# EAGLE schematic NRF8001_BLE_COMMS (EAGLE 7.7.0)
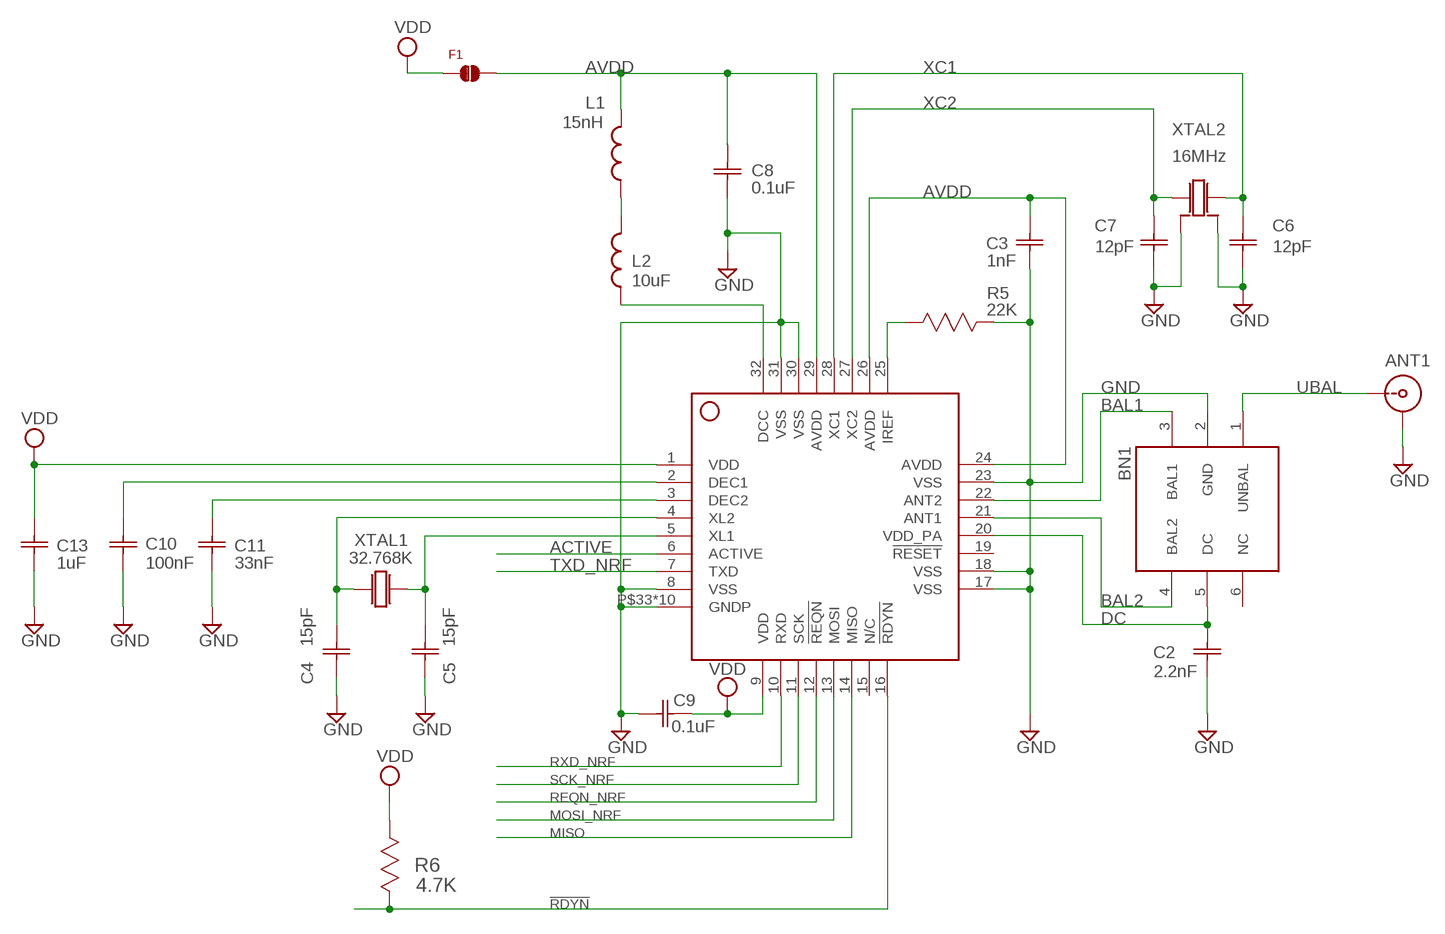
[diagram p0: schematic, sheet 1]

## Parts
ANT1  U.FL-R-SMT(01)  [U.FL]
BN1  2450BM14A0002  [BALUN]
C2  2.2nF  C0603C222K5RACTU  [CAPC1608X85N]
C3  1nF  C0603C102J5GACTU  [CAPC1608X85N]
C4  15pF  C0603C150J5GACTU  [CAPC1608X85N]
C5  15pF  C0603C150J5GACTU  [CAPC1608X85N]
C6  12pF  C0603C120J5GACTU  [CAPC1608X85N]
C7  12pF  C0603C120J5GACTU  [CAPC1608X85N]
C8  0.1uF  0603YC104K4T4A  [CAPC1608X90N]
C9  0.1uF  0603YC104K4T4A  [CAPC1608X90N]
C10  100nF  06033C104JAT2A  [CAPC1608X90N]
C11  33nF  C0603C333K5RACTU  [CAPC1608X85N]
C13  1uF  0603YD105MAT4A  [CAPC1608X90N]
F1  MMZ1608B121C  [0603]
L1  15nH  HK100515NJ-T  [0402]
L2  10uF  LBMF1608T100K  [0603]
R5  22K  MC0.063W06031%22K  [RESC1608X60N]
R6  4.7K  MC0.063W06031%4K7  [RESC1608X60N]
U2  NRF8001  [QFN50P500X500X90-33N]
XTAL1  32.768K  NX3215SA-32.768K-STD-MUA-9  [3215]
XTAL2  16MHz  TSX-3225-16.0000MF18X-AC3  [3225]

## Nets
!RDYN: R6.2(R2) U2.16(!RDYN)
ACTIVE: U2.6(ACTIVE)
AVDD: C3.2(C2) C8.2(C2) F1.P$2 L1.P$2 U2.24(AVDD) U2.26(AVDD) U2.29(AVDD)
BAL1: BN1.3(BAL1) U2.22(ANT2)
BAL2: BN1.4(BAL2) U2.21(ANT1)
DC: BN1.5(DC) C2.2(C2) U2.20(VDD_PA)
GND: ANT1.2 ANT1.3 BN1.2(GND) C2.1(C1) C3.1(C1) C4.1(C1) C5.1(C1) C6.1(C1) C7.1(C1) C8.1(C1) C9.2(C2) C10.1(C1) C11.2(C2) C13.1(C1) R5.1(R1) U2.8(VSS) U2.17(VSS) U2.18(VSS) U2.23(VSS) U2.30(VSS) U2.31(VSS) U2.P$33(GNDP) U2.P$34(GNDP) U2.P$35(GNDP) U2.P$36(GNDP) U2.P$37(GNDP) U2.P$38(GNDP) U2.P$39(GNDP) U2.P$40(GNDP) U2.P$41(GNDP) U2.P$42(GNDP) XTAL2.2 XTAL2.4
MISO: U2.14(MISO)
MOSI_NRF: U2.13(MOSI)
N$4: R5.2(R2) U2.25(IREF)
N$5: C4.2(C2) U2.4(XL2) XTAL1.2
N$7: C5.2(C2) U2.5(XL1) XTAL1.1
N$11: L1.P$1 L2.2
N$12: L2.1 U2.32(DCC)
N$14: C11.1(C1) U2.3(DEC2)
N$15: C10.2(C2) U2.2(DEC1)
REQN_NRF: U2.12(!REQN)
RXD_NRF: U2.10(RXD)
SCK_NRF: U2.11(SCK)
TXD_NRF: U2.7(TXD)
UBAL: ANT1.1 BN1.1(UNBAL)
VDD: C9.1(C1) C13.2(C2) F1.P$1 R6.1(R1) U2.1(VDD) U2.9(VDD)
XC1: C6.2(C2) U2.28(XC1) XTAL2.3
XC2: C7.2(C2) U2.27(XC2) XTAL2.1
Unconnected: BN1.6(NC) U2.15(N/C) U2.19(!RESET)

## Library data of the parts
ANT1 = U.FL-R-SMT(01):U.FL-R-SMT(01); MANUFACTURER: HIROSE; PARTNO: U.FL-R-SMT(01)
BN1 = 2450BM14A0002:2450BM14A0002; MANUFACTURER: JOHANSON; PARTNO: 2450BM14A0002
C2 = Kemet:C0603C222K5RACTU: CAPACITOR, 0603; MPN: C0603C222K5RACTU; OC_FARNELL: 1414624; OC_NEWARK: 64K2852; SUPPLIER: Kemet; TOLERANCE: ±10%; VOLTAGERATING: 50V
C3 = Kemet:C0603C102J5GACTU: CAPACITOR, 0603; MPN: C0603C102J5GACTU; OC_FARNELL: 1414605; OC_NEWARK: 86H9967; SUPPLIER: Kemet; TOLERANCE: ±5%; VOLTAGERATING: 50V
C4 C5 = Kemet:C0603C150J5GACTU: CAPACITOR, 0603; MPN: C0603C150J5GACTU; OC_FARNELL: 1414614; OC_NEWARK: 70K9092; SUPPLIER: Kemet; TOLERANCE: ±5%; VOLTAGERATING: 50V
C6 C7 = Kemet:C0603C120J5GACTU: CAPACITOR, 0603; MPN: C0603C120J5GACTU; OC_FARNELL: 1414612; OC_NEWARK: 19C1214; SUPPLIER: Kemet; TOLERANCE: ±5%; VOLTAGERATING: 50V
C8 C9 = AVX:0603YC104K4T4A: Capacitor, 0603; MPN: 0603YC104K4T4A; OC_FARNELL: 1833863; OC_NEWARK: 85R5663; SUPPLIER: AVX; TOLERANCE: ±10%; VALUE: 0.1UF; VOLTAGERATING: 16V
C10 = AVX:06033C104JAT2A: Capacitor 0603; MPN: 06033C104JAT2A; OC_FARNELL: 1740614; OC_NEWARK: 60R6215; SUPPLIER: AVX; TOLERANCE: ±5%; VOLTAGERATING: 25V
C11 = Kemet:C0603C333K5RACTU: CAPACITOR, 0603; MPN: C0603C333K5RACTU; OC_FARNELL: 1414636; OC_NEWARK: 53M7207; SUPPLIER: Kemet; TOLERANCE: ±10%; VOLTAGERATING: 50V
C13 = AVX:0603YD105MAT4A: Capacitor, 0603; MPN: 0603YD105MAT4A; OC_FARNELL: -; OC_NEWARK: 55J2728; SUPPLIER: AVX; TOLERANCE: ±20%; VALUE: 1UF; VOLTAGERATING: 16V
F1 = MMZ1608B121C:MMZ1608B121C
L1 = HK100515NJ-T:HK100515NJ-T
L2 = IND:LBMF1608T100K
R5 = Multicomp:MC0.063W06031%22K: RESISTOR, 0603; MPN: MC0.063W06031%22K; OC_FARNELL: 9330828; OC_NEWARK: 38K9987; SUPPLIER: Multicomp; TOLERANCE: ±1%; VALUE: 22K Ohms; WATTAGE: 1/16 W
R6 = Multicomp:MC0.063W06031%4K7: RESISTOR, 0603; MPN: MC0.063W06031%4K7; OC_FARNELL: 9331247; OC_NEWARK: -; SUPPLIER: Multicomp; TOLERANCE: 1%; VALUE: 4.7K Ohms; WATTAGE: 1/16 W
U2 = NRF8001:NRF8001; MANUFACTURER: NORDIC SEMICONDUCTOR; PARTNO: nRF8001
XTAL1 = XTAL:NX3215SA-32.768K-STD-MUA-9: 32.768K Crystal Oscillator
XTAL2 = XTAL-16MHZ:TSX-3225-16.0000MF18X-AC3: TSX-3225 16.0000MF18X-AC3 16MHz Crystal